# Altium schematic sheet 18.LPDDR4_LPDDR4x_2.SchDoc
size A4; SheetNumber: 18; SheetTotal: 21
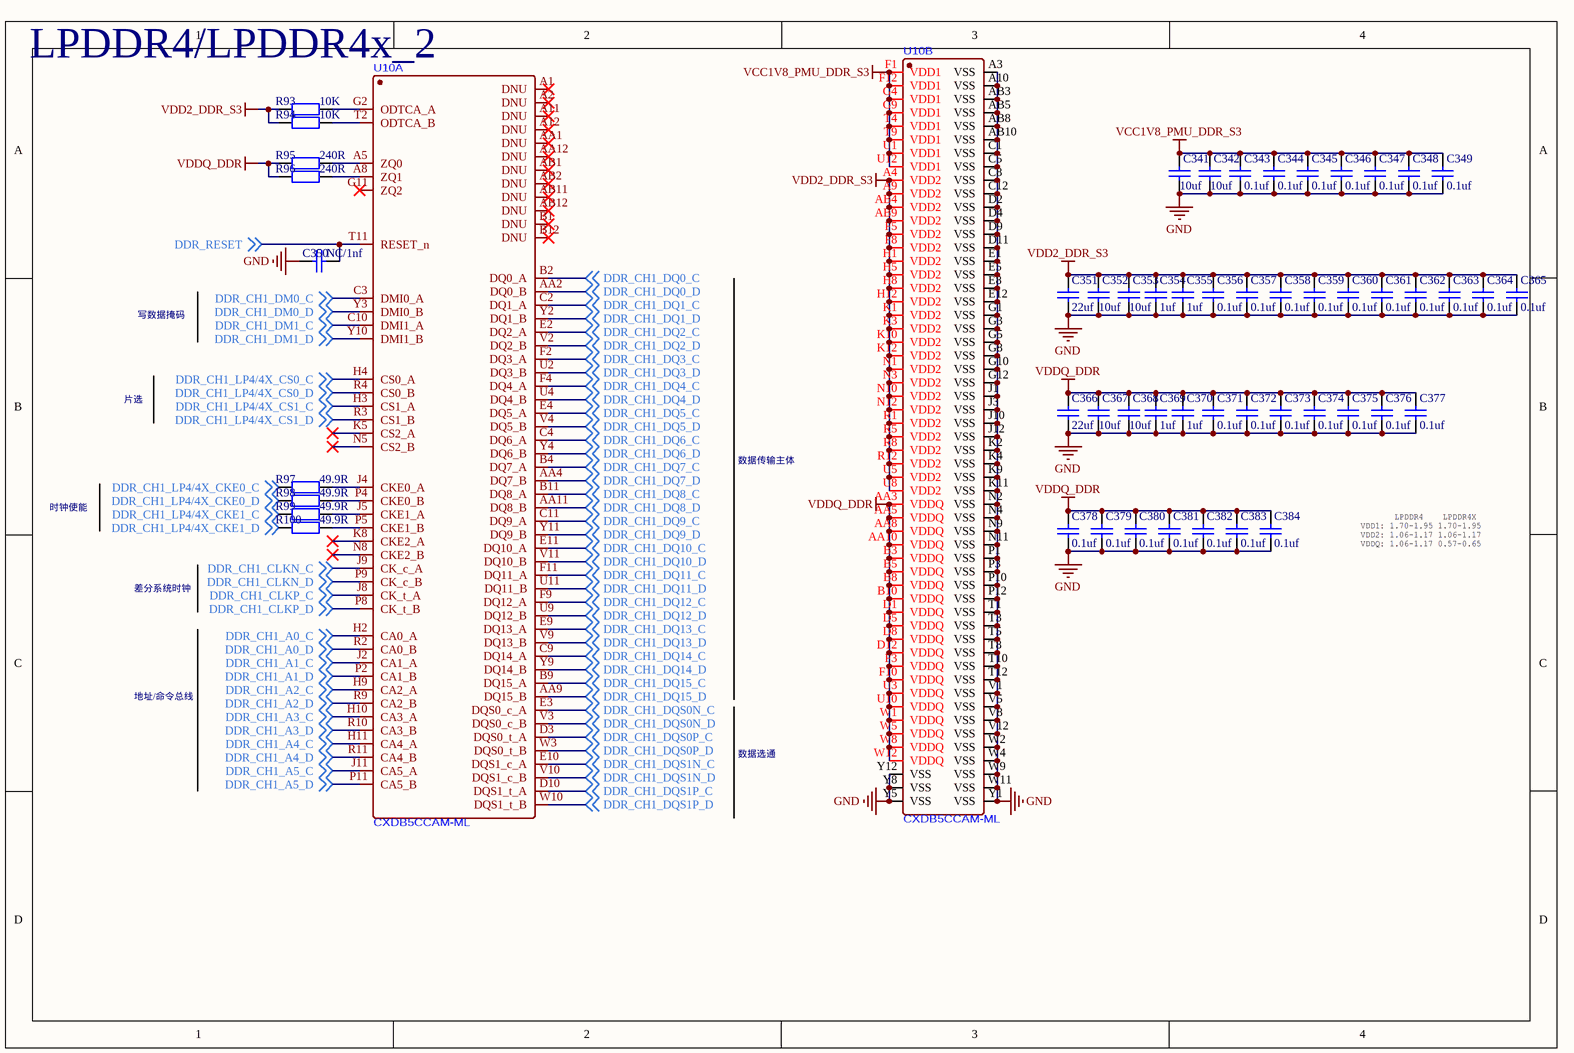
[diagram p0: 18.LPDDR4_LPDDR4x_2.SchDoc]

## Parts
C341  10uf  [C0402_L]
C342  10uf  [C0402_L]
C343  0.1uf  [C0201_L]
C344  0.1uf  [C0201_L]
C345  0.1uf  [C0201_L]
C346  0.1uf  [C0201_L]
C347  0.1uf  [C0201_L]
C348  0.1uf  [C0201_L]
C349  0.1uf  [C0201_L]
C350  NC/1nf  [C0201_L]
C351  22uf  [C0603_L]
C352  10uf  [C0402_L]
C353  10uf  [C0402_L]
C354  1uf  [C0201_L]
C355  1uf  [C0201_L]
C356  0.1uf  [C0201_L]
C357  0.1uf  [C0201_L]
C358  0.1uf  [C0201_L]
C359  0.1uf  [C0201_L]
C360  0.1uf  [C0201_L]
C361  0.1uf  [C0201_L]
C362  0.1uf  [C0201_L]
C363  0.1uf  [C0201_L]
C364  0.1uf  [C0201_L]
C365  0.1uf  [C0201_L]
C366  22uf  [C0603_L]
C367  10uf  [C0402_L]
C368  10uf  [C0402_L]
C369  1uf  [C0201_L]
C370  1uf  [C0201_L]
C371  0.1uf  [C0201_L]
C372  0.1uf  [C0201_L]
C373  0.1uf  [C0201_L]
C374  0.1uf  [C0201_L]
C375  0.1uf  [C0201_L]
C376  0.1uf  [C0201_L]
C377  0.1uf  [C0201_L]
C378  0.1uf  [C0201_L]
C379  0.1uf  [C0201_L]
C380  0.1uf  [C0201_L]
C381  0.1uf  [C0201_L]
C382  0.1uf  [C0201_L]
C383  0.1uf  [C0201_L]
C384  0.1uf  [C0201_L]
R93  10K  [R0201_L]
R94  10K  [R0201_L]
R95  240R  [R0201_L]
R96  240R  [R0201_L]
R97  49.9R  [R0201_L]
R98  49.9R  [R0201_L]
R99  49.9R  [R0201_L]
R100  49.9R  [R0201_L]
U10  CXDB5CCAM-ML  [FBGA-200_L15.0-W10.0-BL_K4F6E3S4HM]  (parts A,B of 2)

## Nets
GND: C341.1 C342.1 C343.1 C344.1 C345.1 C346.1 C347.1 C348.1 C349.1 C350.1 C351.1 C352.1 C353.1 C354.1 C355.1 C356.1 C357.1 C358.1 C359.1 C360.1 C361.1 C362.1 C363.1 C364.1 C365.1 C366.1 C367.1 C368.1 C369.1 C370.1 C371.1 C372.1 C373.1 C374.1 C375.1 C376.1 C377.1 C378.1 C379.1 C380.1 C381.1 C382.1 C383.1 C384.1 U10.A3(VSS) U10.A10(VSS) U10.AB3(VSS) U10.AB5(VSS) U10.AB8(VSS) U10.AB10(VSS) U10.C1(VSS) U10.C5(VSS) U10.C8(VSS) U10.C12(VSS) U10.D2(VSS) U10.D4(VSS) U10.D9(VSS) U10.D11(VSS) U10.E1(VSS) U10.E5(VSS) U10.E8(VSS) U10.E12(VSS) U10.G1(VSS) U10.G3(VSS) U10.G5(VSS) U10.G8(VSS) U10.G10(VSS) U10.G12(VSS) U10.J1(VSS) U10.J3(VSS) U10.J10(VSS) U10.J12(VSS) U10.K2(VSS) U10.K4(VSS) U10.K9(VSS) U10.K11(VSS) U10.N2(VSS) U10.N4(VSS) U10.N9(VSS) U10.N11(VSS) U10.P1(VSS) U10.P3(VSS) U10.P10(VSS) U10.P12(VSS) U10.T1(VSS) U10.T3(VSS) U10.T5(VSS) U10.T8(VSS) U10.T10(VSS) U10.T12(VSS) U10.V1(VSS) U10.V5(VSS) U10.V8(VSS) U10.V12(VSS) U10.W2(VSS) U10.W4(VSS) U10.W9(VSS) U10.W11(VSS) U10.Y1(VSS) U10.Y5(VSS) U10.Y8(VSS) U10.Y12(VSS)
VCC1V8_PMU_DDR_S3: C341.2 C342.2 C343.2 C344.2 C345.2 C346.2 C347.2 C348.2 C349.2 U10.F1(VDD1) U10.F12(VDD1) U10.G4(VDD1) U10.G9(VDD1) U10.T4(VDD1) U10.T9(VDD1) U10.U1(VDD1) U10.U12(VDD1)
VDD2_DDR_S3: C351.2 C352.2 C353.2 C354.2 C355.2 C356.2 C357.2 C358.2 C359.2 C360.2 C361.2 C362.2 C363.2 C364.2 C365.2 R93.1 R94.1 U10.A4(VDD2) U10.A9(VDD2) U10.AB4(VDD2) U10.AB9(VDD2) U10.F5(VDD2) U10.F8(VDD2) U10.H1(VDD2) U10.H5(VDD2) U10.H8(VDD2) U10.H12(VDD2) U10.K1(VDD2) U10.K3(VDD2) U10.K10(VDD2) U10.K12(VDD2) U10.N1(VDD2) U10.N3(VDD2) U10.N10(VDD2) U10.N12(VDD2) U10.R1(VDD2) U10.R5(VDD2) U10.R8(VDD2) U10.R12(VDD2) U10.U5(VDD2) U10.U8(VDD2)
VDDQ_DDR: C366.2 C367.2 C368.2 C369.2 C370.2 C371.2 C372.2 C373.2 C374.2 C375.2 C376.2 C377.2 C378.2 C379.2 C380.2 C381.2 C382.2 C383.2 C384.2 R95.1 R96.1 U10.AA3(VDDQ) U10.AA5(VDDQ) U10.AA8(VDDQ) U10.AA10(VDDQ) U10.B3(VDDQ) U10.B5(VDDQ) U10.B8(VDDQ) U10.B10(VDDQ) U10.D1(VDDQ) U10.D5(VDDQ) U10.D8(VDDQ) U10.D12(VDDQ) U10.F3(VDDQ) U10.F10(VDDQ) U10.U3(VDDQ) U10.U10(VDDQ) U10.W1(VDDQ) U10.W5(VDDQ) U10.W8(VDDQ) U10.W12(VDDQ)
DDR_CH1_A0_C: U10.H2(CA0_A) ; off-sheet DDR_CH1_A0_C
DDR_CH1_A0_D: U10.R2(CA0_B) ; off-sheet DDR_CH1_A0_D
DDR_CH1_A1_C: U10.J2(CA1_A) ; off-sheet DDR_CH1_A1_C
DDR_CH1_A1_D: U10.P2(CA1_B) ; off-sheet DDR_CH1_A1_D
DDR_CH1_A2_C: U10.H9(CA2_A) ; off-sheet DDR_CH1_A2_C
DDR_CH1_A2_D: U10.R9(CA2_B) ; off-sheet DDR_CH1_A2_D
DDR_CH1_A3_C: U10.H10(CA3_A) ; off-sheet DDR_CH1_A3_C
DDR_CH1_A3_D: U10.R10(CA3_B) ; off-sheet DDR_CH1_A3_D
DDR_CH1_A4_C: U10.H11(CA4_A) ; off-sheet DDR_CH1_A4_C
DDR_CH1_A4_D: U10.R11(CA4_B) ; off-sheet DDR_CH1_A4_D
DDR_CH1_A5_C: U10.J11(CA5_A) ; off-sheet DDR_CH1_A5_C
DDR_CH1_A5_D: U10.P11(CA5_B) ; off-sheet DDR_CH1_A5_D
DDR_CH1_CLKN_C: U10.J9(CK_c_A) ; off-sheet DDR_CH1_CLKN_C
DDR_CH1_CLKN_D: U10.P9(CK_c_B) ; off-sheet DDR_CH1_CLKN_D
DDR_CH1_CLKP_C: U10.J8(CK_t_A) ; off-sheet DDR_CH1_CLKP_C
DDR_CH1_CLKP_D: U10.P8(CK_t_B) ; off-sheet DDR_CH1_CLKP_D
DDR_CH1_DM0_C: U10.C3(DMI0_A) ; off-sheet DDR_CH1_DM0_C
DDR_CH1_DM0_D: U10.Y3(DMI0_B) ; off-sheet DDR_CH1_DM0_D
DDR_CH1_DM1_C: U10.C10(DMI1_A) ; off-sheet DDR_CH1_DM1_C
DDR_CH1_DM1_D: U10.Y10(DMI1_B) ; off-sheet DDR_CH1_DM1_D
DDR_CH1_DQ0_C: U10.B2(DQ0_A) ; off-sheet DDR_CH1_DQ0_C
DDR_CH1_DQ0_D: U10.AA2(DQ0_B) ; off-sheet DDR_CH1_DQ0_D
DDR_CH1_DQ1_C: U10.C2(DQ1_A) ; off-sheet DDR_CH1_DQ1_C
DDR_CH1_DQ1_D: U10.Y2(DQ1_B) ; off-sheet DDR_CH1_DQ1_D
DDR_CH1_DQ2_C: U10.E2(DQ2_A) ; off-sheet DDR_CH1_DQ2_C
DDR_CH1_DQ2_D: U10.V2(DQ2_B) ; off-sheet DDR_CH1_DQ2_D
DDR_CH1_DQ3_C: U10.F2(DQ3_A) ; off-sheet DDR_CH1_DQ3_C
DDR_CH1_DQ3_D: U10.U2(DQ3_B) ; off-sheet DDR_CH1_DQ3_D
DDR_CH1_DQ4_C: U10.F4(DQ4_A) ; off-sheet DDR_CH1_DQ4_C
DDR_CH1_DQ4_D: U10.U4(DQ4_B) ; off-sheet DDR_CH1_DQ4_D
DDR_CH1_DQ5_C: U10.E4(DQ5_A) ; off-sheet DDR_CH1_DQ5_C
DDR_CH1_DQ5_D: U10.V4(DQ5_B) ; off-sheet DDR_CH1_DQ5_D
DDR_CH1_DQ6_C: U10.C4(DQ6_A) ; off-sheet DDR_CH1_DQ6_C
DDR_CH1_DQ6_D: U10.Y4(DQ6_B) ; off-sheet DDR_CH1_DQ6_D
DDR_CH1_DQ7_C: U10.B4(DQ7_A) ; off-sheet DDR_CH1_DQ7_C
DDR_CH1_DQ7_D: U10.AA4(DQ7_B) ; off-sheet DDR_CH1_DQ7_D
DDR_CH1_DQ8_C: U10.B11(DQ8_A) ; off-sheet DDR_CH1_DQ8_C
DDR_CH1_DQ8_D: U10.AA11(DQ8_B) ; off-sheet DDR_CH1_DQ8_D
DDR_CH1_DQ9_C: U10.C11(DQ9_A) ; off-sheet DDR_CH1_DQ9_C
DDR_CH1_DQ9_D: U10.Y11(DQ9_B) ; off-sheet DDR_CH1_DQ9_D
DDR_CH1_DQ10_C: U10.E11(DQ10_A) ; off-sheet DDR_CH1_DQ10_C
DDR_CH1_DQ10_D: U10.V11(DQ10_B) ; off-sheet DDR_CH1_DQ10_D
DDR_CH1_DQ11_C: U10.F11(DQ11_A) ; off-sheet DDR_CH1_DQ11_C
DDR_CH1_DQ11_D: U10.U11(DQ11_B) ; off-sheet DDR_CH1_DQ11_D
DDR_CH1_DQ12_C: U10.F9(DQ12_A) ; off-sheet DDR_CH1_DQ12_C
DDR_CH1_DQ12_D: U10.U9(DQ12_B) ; off-sheet DDR_CH1_DQ12_D
DDR_CH1_DQ13_C: U10.E9(DQ13_A) ; off-sheet DDR_CH1_DQ13_C
DDR_CH1_DQ13_D: U10.V9(DQ13_B) ; off-sheet DDR_CH1_DQ13_D
DDR_CH1_DQ14_C: U10.C9(DQ14_A) ; off-sheet DDR_CH1_DQ14_C
DDR_CH1_DQ14_D: U10.Y9(DQ14_B) ; off-sheet DDR_CH1_DQ14_D
DDR_CH1_DQ15_C: U10.B9(DQ15_A) ; off-sheet DDR_CH1_DQ15_C
DDR_CH1_DQ15_D: U10.AA9(DQ15_B) ; off-sheet DDR_CH1_DQ15_D
DDR_CH1_DQS0N_C: U10.E3(DQS0_c_A) ; off-sheet DDR_CH1_DQS0N_C
DDR_CH1_DQS0N_D: U10.V3(DQS0_c_B) ; off-sheet DDR_CH1_DQS0N_D
DDR_CH1_DQS0P_C: U10.D3(DQS0_t_A) ; off-sheet DDR_CH1_DQS0P_C
DDR_CH1_DQS0P_D: U10.W3(DQS0_t_B) ; off-sheet DDR_CH1_DQS0P_D
DDR_CH1_DQS1N_C: U10.E10(DQS1_c_A) ; off-sheet DDR_CH1_DQS1N_C
DDR_CH1_DQS1N_D: U10.V10(DQS1_c_B) ; off-sheet DDR_CH1_DQS1N_D
DDR_CH1_DQS1P_C: U10.D10(DQS1_t_A) ; off-sheet DDR_CH1_DQS1P_C
DDR_CH1_DQS1P_D: U10.W10(DQS1_t_B) ; off-sheet DDR_CH1_DQS1P_D
DDR_CH1_LP4/4X_CKE0_C: R97.1 ; off-sheet DDR_CH1_LP4/4X_CKE0_C
DDR_CH1_LP4/4X_CKE0_D: R98.1 ; off-sheet DDR_CH1_LP4/4X_CKE0_D
DDR_CH1_LP4/4X_CKE1_C: R99.1 ; off-sheet DDR_CH1_LP4/4X_CKE1_C
DDR_CH1_LP4/4X_CKE1_D: R100.1 ; off-sheet DDR_CH1_LP4/4X_CKE1_D
DDR_CH1_LP4/4X_CS0_C: U10.H4(CS0_A) ; off-sheet DDR_CH1_LP4/4X_CS0_C
DDR_CH1_LP4/4X_CS0_D: U10.R4(CS0_B) ; off-sheet DDR_CH1_LP4/4X_CS0_D
DDR_CH1_LP4/4X_CS1_C: U10.H3(CS1_A) ; off-sheet DDR_CH1_LP4/4X_CS1_C
DDR_CH1_LP4/4X_CS1_D: U10.R3(CS1_B) ; off-sheet DDR_CH1_LP4/4X_CS1_D
DDR_RESET: C350.2 U10.T11(RESET_n) ; off-sheet DDR_RESET
NetR93_2: R93.2 U10.G2(ODTCA_A)
NetR94_2: R94.2 U10.T2(ODTCA_B)
NetR95_2: R95.2 U10.A5(ZQ0)
NetR96_2: R96.2 U10.A8(ZQ1)
NetR97_2: R97.2 U10.J4(CKE0_A)
NetR98_2: R98.2 U10.P4(CKE0_B)
NetR99_2: R99.2 U10.J5(CKE1_A)
NetR100_2: R100.2 U10.P5(CKE1_B)

Not connected (* = marked no-connect by the designer): U10 A1(DNU)* A2(DNU)* A11(DNU)* A12(DNU)* AA1(DNU)* AA12(DNU)* AB1(DNU)* AB2(DNU)* AB11(DNU)* AB12(DNU)* B1(DNU)* B12(DNU)* G11(ZQ2)* K5(CS2_A)* K8(CKE2_A)* N5(CS2_B)* N8(CKE2_B)*

## Notes on the sheet
- (near U10) LPDDR4/LPDDR4x_2
- 写数据掩码
- 片选
- 数据传输主体
- 时钟使能
- 差分系统时钟
- 地址/命令总线
- 数据选通

## Library data of the parts
C341-C384 = C: 贴片电容/MLCC电容
R93-R100 = R: 贴片电阻